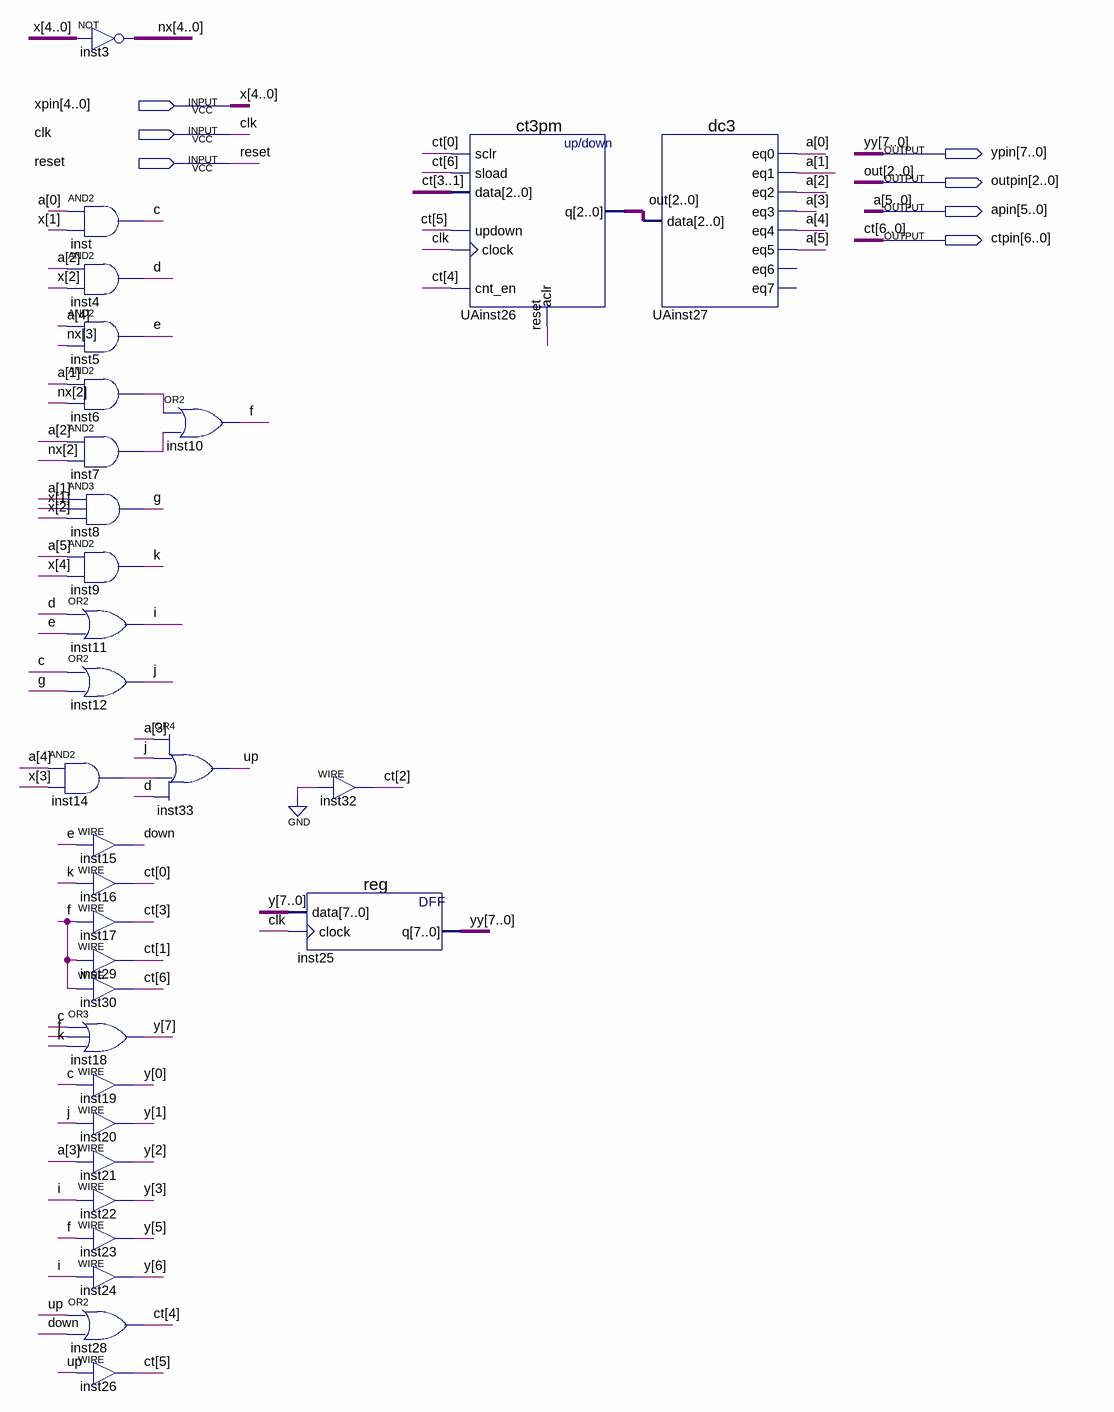
[diagram p0: schematic sheet]
// Quartus schematic test2.bdf as structural Verilog: 31 symbols, 7 pins
module test2 (
  input  [4:0] xpin,
  input  clk,
  input  reset,
  output [7:0] ypin,
  output [2:0] outpin,
  output [5:0] apin,
  output [6:0] ctpin
);

  wire c, d, down, e, f, g, i, inst6_out, inst7_out, inst14_out, j, k, up;
  wire [4:0] nx;
  wire [7:0] y;

  and inst14 (inst14_out, apin[4], xpin[3]);
  assign nx = ~xpin;  // NOT inst3, 5 bits wide
  and inst (c, apin[0], xpin[1]);
  and inst4 (d, apin[2], xpin[2]);
  and inst5 (e, apin[4], nx[3]);
  and inst6 (inst6_out, apin[1], nx[2]);
  and inst7 (inst7_out, apin[2], nx[2]);
  and inst8 (g, apin[1], xpin[1], xpin[2]);
  and inst9 (k, apin[5], xpin[4]);
  or inst11 (i, d, e);
  or inst12 (j, c, g);
  assign down = e;  // WIRE inst15
  assign ctpin[0] = k;  // WIRE inst16
  assign ctpin[3] = f;  // WIRE inst17
  assign ctpin[1] = f;  // WIRE inst29
  assign ctpin[6] = f;  // WIRE inst30
  or inst18 (y[7], c, f, k);
  assign y[0] = c;  // WIRE inst19
  assign y[1] = j;  // WIRE inst20
  assign y[2] = apin[3];  // WIRE inst21
  assign y[3] = i;  // WIRE inst22
  assign y[5] = f;  // WIRE inst23
  assign y[6] = i;  // WIRE inst24
  or inst28 (ctpin[4], up, down);
  assign ctpin[5] = up;  // WIRE inst26
  or inst10 (f, inst6_out, inst7_out);
  or inst33 (up, apin[3], j, inst14_out, d);
  assign ctpin[2] = 1'b0;  // WIRE inst32
  \reg  inst25 (.data(y), .clock(clk), .q(ypin));
  ct3pm UAinst26 (
    .sclr(ctpin[0]), .sload(ctpin[6]), .data(ctpin[3:1]), .updown(ctpin[5]), .clock(clk), .cnt_en(ctpin[4]),
    .aclr(reset), .q(outpin));
  dc3 UAinst27 (
    .data(outpin), .eq0(apin[0]), .eq1(apin[1]), .eq2(apin[2]), .eq3(apin[3]), .eq4(apin[4]), .eq5(apin[5]));  // open: eq6, eq7

  // Other names for the same wires on the sheet: a[5:0] = apin; ct[6:0] = ctpin; out[2:0] = outpin; x[4:0] = xpin;
  //   yy[7:0] = ypin
endmodule
